# Altium schematic sheet myLEDBlinker.SchDoc
size Letter
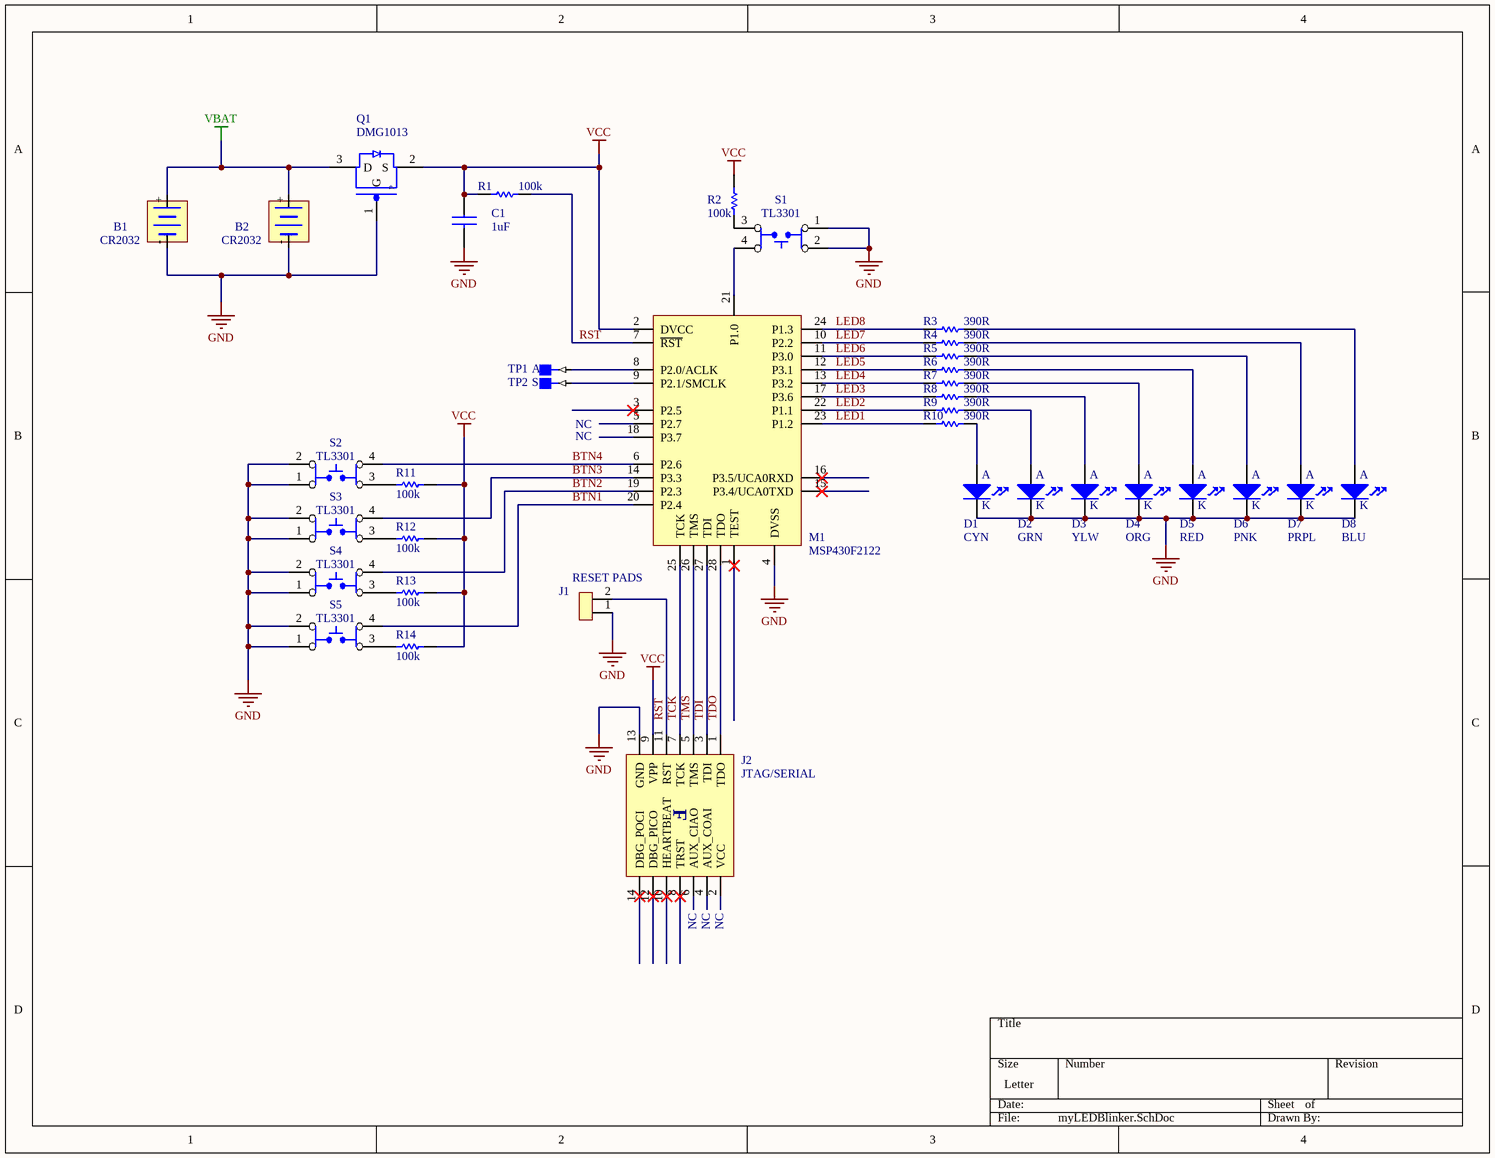
[diagram p0: myLEDBlinker.SchDoc]

## Parts
B1  CR2032  [CONN BATTERY HOLDER CR2032]
B2  CR2032  [CONN BATTERY HOLDER CR2032]
C1  1uF  [0603]
D1  CYN  [PLCC-2 AK]
D2  GRN  [PLCC-2 AK]
D3  YLW  [PLCC-2 AK]
D4  ORG  [PLCC-2 AK]
D5  RED  [PLCC-2 AK]
D6  PNK  [PLCC-2 AK]
D7  PRPL  [PLCC-2 AK]
D8  BLU  [PLCC-2 AK]
J1  RESET PADS  [HDR1X2]
J2  JTAG/SERIAL  [CONN 14POS 7X2 SMT FEMALE SMALL]
M1  MSP430F2122  [TSSOP28]
Q1  DMG1013  [SC-70-3]
R1  100k  [0603]
R2  100k  [0603]
R3  390R  [0603]
R4  390R  [0603]
R5  390R  [0603]
R6  390R  [0603]
R7  390R  [0603]
R8  390R  [0603]
R9  390R  [0603]
R10  390R  [0603]
R11  100k  [0603]
R12  100k  [0603]
R13  100k  [0603]
R14  100k  [0603]
S1  TL3301  [SWITCH TACT SMT TL3301 J LEAD]
S2  TL3301  [SWITCH TACT SMT TL3301 J LEAD]
S3  TL3301  [SWITCH TACT SMT TL3301 J LEAD]
S4  TL3301  [SWITCH TACT SMT TL3301 J LEAD]
S5  TL3301  [SWITCH TACT SMT TL3301 J LEAD]
TP1  A  [TEST POINT SMT]  (no BOM)
TP2  S  [TEST POINT SMT]  (no BOM)

## Nets
GND: B1.- B2.- C1.2 D1.K D2.K D3.K D4.K D5.K D6.K D7.K D8.K J1.1 J2.13(GND) M1.4(DVSS) Q1.1(G) S1.1(X1) S1.2(X2) S2.1(X1) S2.2(X2) S3.1(X1) S3.2(X2) S4.1(X1) S4.2(X2) S5.1(X1) S5.2(X2)
VBAT: B1.+ B2.+ Q1.3(D)
VCC: C1.1 J2.9(VPP) M1.2(DVCC) Q1.2(S) R1.1 R2.2 R11.1 R12.1 R13.1 R14.1
BTN1: M1.20(P2.4) S5.4(Y2)
BTN2: M1.19(P2.3) S4.4(Y2)
BTN3: M1.14(P3.3) S3.4(Y2)
BTN4: M1.6(P2.6) S2.4(Y2)
LED1: M1.23(P1.2) R10.1
LED2: M1.22(P1.1) R9.1
LED3: M1.17(P3.6) R8.1
LED4: M1.13(P3.2) R7.1
LED5: M1.12(P3.1) R6.1
LED6: M1.11(P3.0) R5.1
LED7: M1.10(P2.2) R4.1
LED8: M1.24(P1.3) R3.1
RST: J1.2 J2.11(RST) M1.7(~{RST}) R1.2
TCK: J2.7(TCK) M1.25(TCK)
TDI: J2.3(TDI) M1.27(TDI)
TDO: J2.1(TDO) M1.28(TDO)
TMS: J2.5(TMS) M1.26(TMS)
NetD1_A: D1.A R10.2
NetD2_A: D2.A R9.2
NetD3_A: D3.A R8.2
NetD4_A: D4.A R7.2
NetD5_A: D5.A R6.2
NetD6_A: D6.A R5.2
NetD7_A: D7.A R4.2
NetD8_A: D8.A R3.2
NetM1_8: M1.8(P2.0/ACLK) TP1.1
NetM1_9: M1.9(P2.1/SMCLK) TP2.1
NetM1_21: M1.21(P1.0) S1.4(Y2)
NetR2_1: R2.1 S1.3(Y1)
NetR11_2: R11.2 S2.3(Y1)
NetR12_2: R12.2 S3.3(Y1)
NetR13_2: R13.2 S4.3(Y1)
NetR14_2: R14.2 S5.3(Y1)

Not connected (* = marked no-connect by the designer): J2 2(VCC) 4(AUX_COAI) 6(AUX_CIAO) 8(TRST)* 10(HEARTBEAT)* 12(DBG_PICO)* 14(DBG_POCI)*; M1 1(TEST)* 3(P2.5)* 5(P2.7) 15(P3.4/UCA0TXD)* 16(P3.5/UCA0RXD)* 18(P3.7)

## Notes on the sheet
- NC
- (near J2) NC
- (in symbol CONN JTAG/SERIAL FEMALE) F
- (in symbol TRANS PMOS 1G 2S 3D) P

## Library data of the parts
B1 B2 = CONN BATTERY HOLDER CR2032: 3V Coincell Battery; 2. Manufacturer: FCI; 3. Manufacturer Part Number: BK-912; 5. Internal Part Number: 100192; 1. Description: CONN HOLDER COIN CELL 20MM SMD; 7. Modified By: JRL; 4. Digi-Key Part Number: BK-912-ND; 6. Last Modified: 2012-09-03
C1 = CAPACITOR NON-POLARIZED: 1. Description: CAP [TYPE] [VALUE] [TOLERANCE] [VOLTAGE] [CLASS] [PACKAGE]; 5. Internal Part Number: *; 4. Digi-Key Part Number: *; 3. Manufacturer Part Number: *; 6. Last Modified: *; 7. Modified By: *; 2. Manufacturer: *
D1 = LED AK: CYAN; 1. Description: LED [COLOR] [STYLE] [PACKAGE] [MOUNT]; 2. Manufacturer: *; 3. Manufacturer Part Number: *; 4. Digi-Key Part Number: *; 5. Internal Part Number: *; 6. Last Modified: *; 7. Modified By: *
D2 = LED AK: GREEN; 1. Description: LED [COLOR] [STYLE] [PACKAGE] [MOUNT]; 2. Manufacturer: *; 3. Manufacturer Part Number: *; 4. Digi-Key Part Number: *; 5. Internal Part Number: *; 6. Last Modified: *; 7. Modified By: *
D3 = LED AK: YELLOW; 1. Description: LED [COLOR] [STYLE] [PACKAGE] [MOUNT]; 2. Manufacturer: *; 3. Manufacturer Part Number: *; 4. Digi-Key Part Number: *; 5. Internal Part Number: *; 6. Last Modified: *; 7. Modified By: *
D4 = LED AK: ORANGE; 1. Description: LED [COLOR] [STYLE] [PACKAGE] [MOUNT]; 2. Manufacturer: *; 3. Manufacturer Part Number: *; 4. Digi-Key Part Number: *; 5. Internal Part Number: *; 6. Last Modified: *; 7. Modified By: *
D5 = LED AK: 1. Description: LED [COLOR] [STYLE] [PACKAGE] [MOUNT]; 2. Manufacturer: *; 3. Manufacturer Part Number: *; 4. Digi-Key Part Number: *; 5. Internal Part Number: *; 6. Last Modified: *; 7. Modified By: *
D6 = LED AK: PINK; 1. Description: LED [COLOR] [STYLE] [PACKAGE] [MOUNT]; 2. Manufacturer: *; 3. Manufacturer Part Number: *; 4. Digi-Key Part Number: *; 5. Internal Part Number: *; 6. Last Modified: *; 7. Modified By: *
D7 = LED AK: PURPLE; 1. Description: LED [COLOR] [STYLE] [PACKAGE] [MOUNT]; 2. Manufacturer: *; 3. Manufacturer Part Number: *; 4. Digi-Key Part Number: *; 5. Internal Part Number: *; 6. Last Modified: *; 7. Modified By: *
D8 = LED AK: BLUE; 1. Description: LED [COLOR] [STYLE] [PACKAGE] [MOUNT]; 2. Manufacturer: *; 3. Manufacturer Part Number: *; 4. Digi-Key Part Number: *; 5. Internal Part Number: *; 6. Last Modified: *; 7. Modified By: *
J1 = CONN SIP 2: 2. Manufacturer: *; 3. Manufacturer Part Number: *; 1. Description: *; 4. Digi-Key Part Number: *; 5. Internal Part Number: *; 6. Last Modified: *; 7. Modified By: *
J2 = CONN JTAG/SERIAL FEMALE: 2. Manufacturer: FCI; 3. Manufacturer Part Number: 20021321-00014T4LF; 5. Internal Part Number: 100254; 1. Description: CONN TERMINAL 14POS 7X12 1.27MM VERT SMD; 7. Modified By: BJW; 4. Digi-Key Part Number: 609-3771-ND; 6. Last Modified: 2018-10-07
M1 = MCU MSP430F2122 TSSOP28: 2. Manufacturer: TI; 3. Manufacturer Part Number: MSP430F2122TPWR; 1. Description: MCU MSP430F2122 TSSOP28 LED BLINKER; 7. Modified By: BJW; 4. Digi-Key Part Number: 296-23365-ND; 5. Internal Part Number: *; 6. Last Modified: 2018-10-07
Q1 = TRANS PMOS 1G 2S 3D: 2. Manufacturer: *; 3. Manufacturer Part Number: *; 4. Digi-Key Part Number: *; 5. Internal Part Number: *; 6. Last Modified: *; 7. Modified By: *
R1-R14 = RESISTOR: 1. Description: RES [VALUE] [POWER] [TOLERANCE] [PACKAGE] [CONSTRUCTION]; 5. Internal Part Number: *; 4. Digi-Key Part Number: *; 2. Manufacturer: *; 3. Manufacturer Part Number: *; 6. Last Modified: *; 7. Modified By: *
S1-S5 = SWITCH SPST TL3301 JLEAD: SPST TACT SWITCH; 2. Manufacturer: E-Switch; 3. Manufacturer Part Number: TL3301xxx; 1. Description: SWITCH TACT 260GF H=5.0MM SMT; 7. Modified By: JRL; 6. Last Modified: 2014-10-24
TP1 TP2 = TEST POINT SMT: 1. Description: Test pad; 7. Modified By: JRL; 2. Manufacturer: N/A; 3. Manufacturer Part Number: N/A; 4. Digi-key Part Number: N/A; 5. Internal Part Number: N/A; 6. Last Modified: June 12, 2008